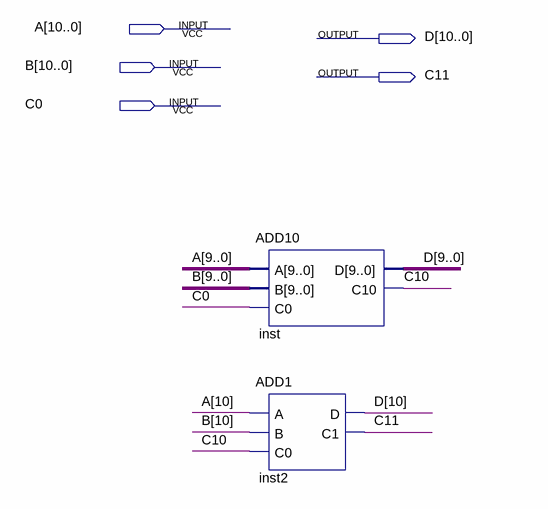
[diagram p0: schematic sheet]
// Quartus schematic ADD11.bdf as structural Verilog: 2 symbols, 5 pins
module ADD11 (
  input  [10:0] A,
  input  [10:0] B,
  input  C0,
  output [10:0] D,
  output C11
);

  wire C10;

  ADD10 inst (.A(A[9:0]), .B(B[9:0]), .C0(C0), .D(D[9:0]), .C10(C10));
  ADD1 inst2 (.A(A[10]), .B(B[10]), .C0(C10), .D(D[10]), .C1(C11));
endmodule
